# EAGLE design astable_555_timer (EAGLE 9.6.2)
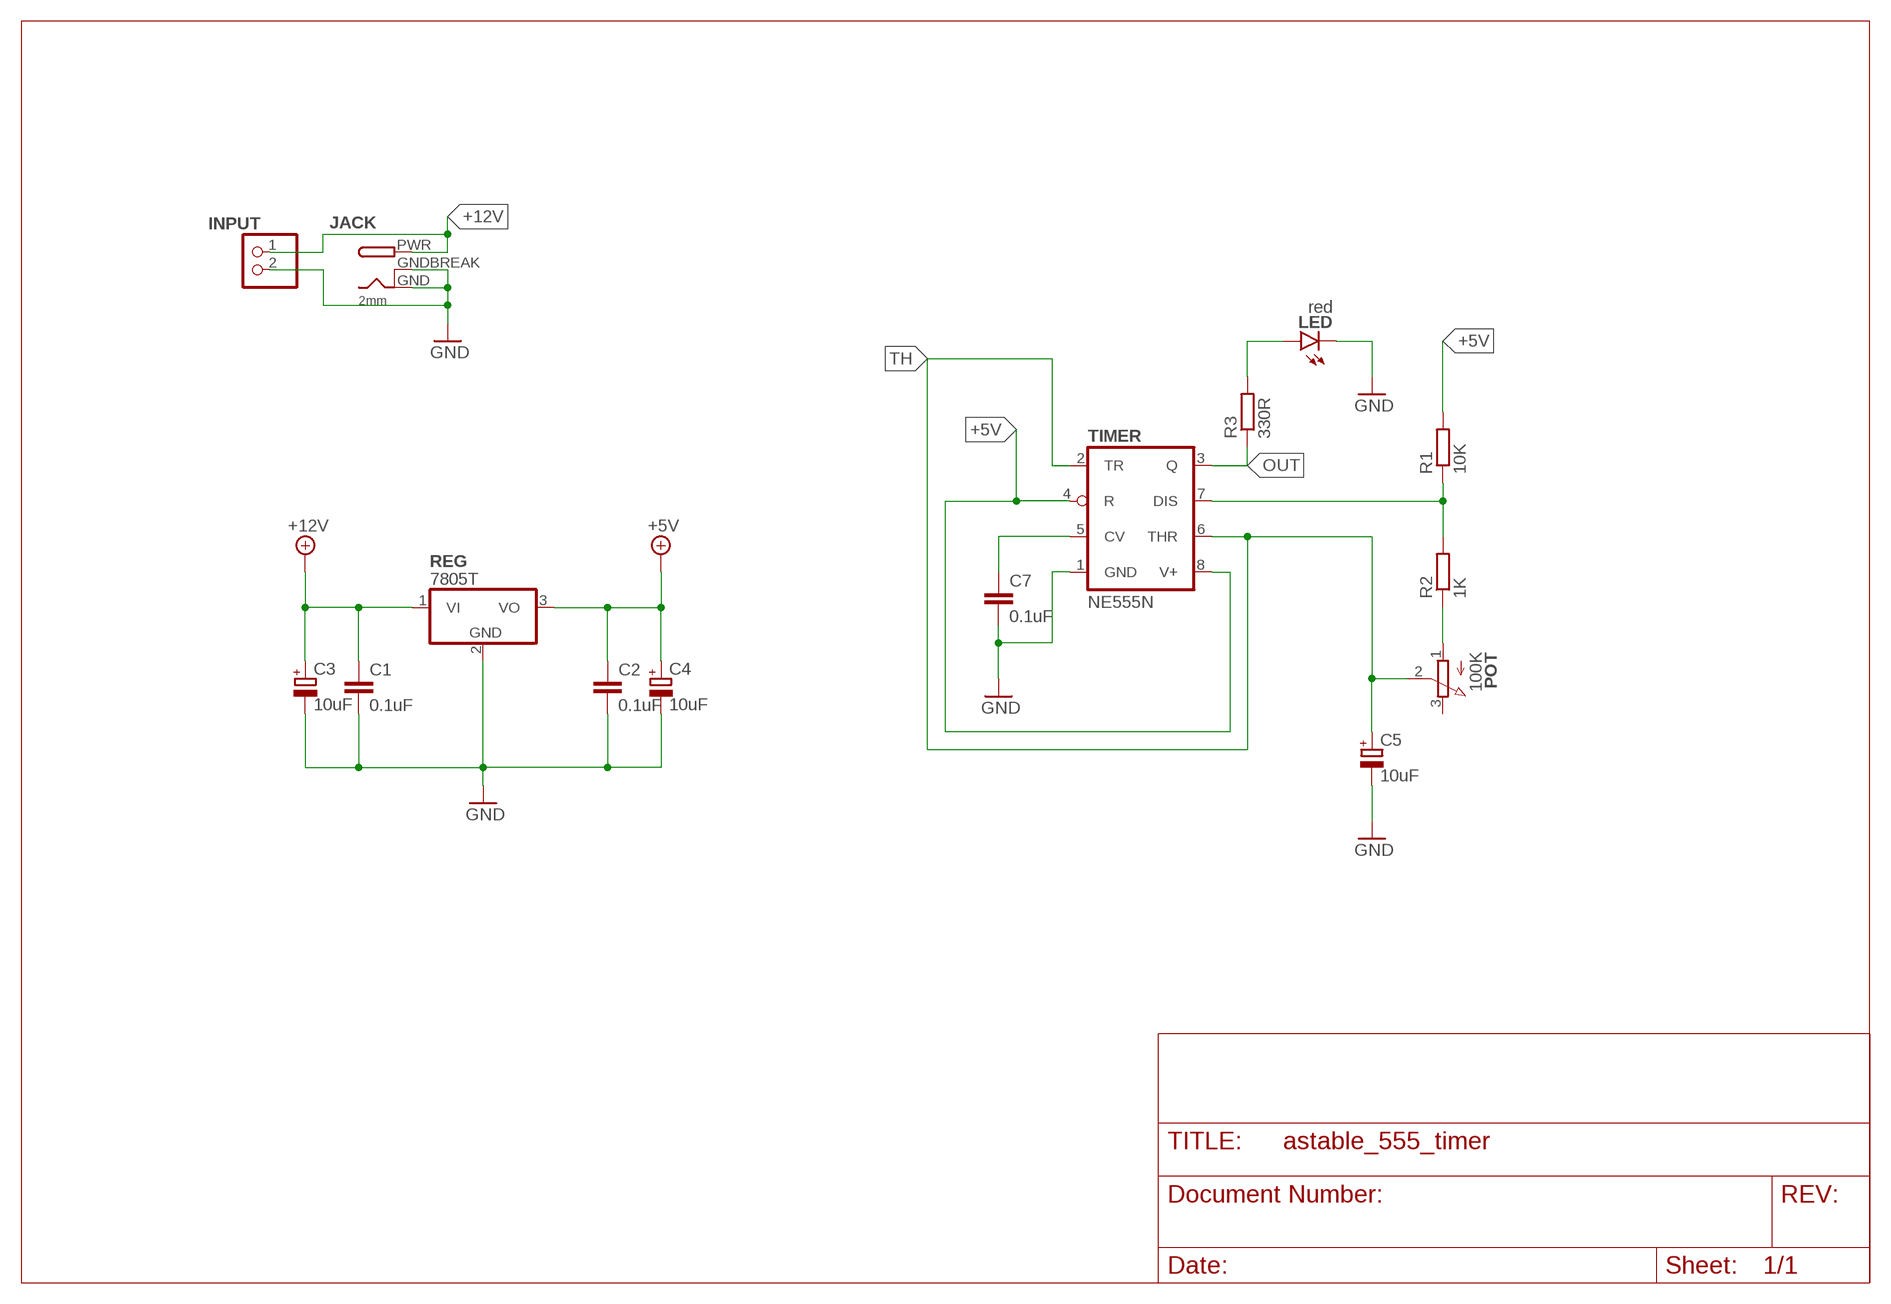
[diagram p0: schematic, sheet 1]

## Parts
C1  0.1uF  C-EU050-030X075  [C050-030X075]
C2  0.1uF  C-EU050-030X075  [C050-030X075]
C3  10uF  CPOL-EUE3.5-8  [E3,5-8]
C4  10uF  CPOL-EUE3.5-8  [E3,5-8]
C5  10uF  CPOL-EUE3.5-8  [E3,5-8]
C7  0.1uF  C-EU050-030X075  [C050-030X075]
INPUT  PINHD-1X2  [1X02]
JACK  2mm  DCBARRELPTH  [DCJACK_2MM_PTH]
LED  red  LED5MM  [LED5MM]
POT  100K  3RP/1610N  [3RP/1610N]
R1  10K  R-EU_0207/10  [0207/10]
R2  1K  R-EU_0207/10  [0207/10]
R3  330R  R-EU_0207/10  [0207/10]
REG  7805T  [TO220H]
TIMER  NE555N  [DIL08]

## Nets
+5V [power]: C2.1 C4.+ R1.2 REG.3(VO) TIMER.4(R) TIMER.8(V+)
+12V [power]: C1.1 C3.+ INPUT.1 JACK.PWR REG.1(VI)
GND: C1.2 C2.2 C3.- C4.- C5.- C7.2 INPUT.2 JACK.GND JACK.GNDBREAK LED.K(C) REG.2(GND) TIMER.1(GND)
N$3: LED.A R3.2
N$4: R1.1 R2.2 TIMER.7(DIS)
N$5: POT.1(A) R2.1
N$6: C7.1 TIMER.5(CV)
OUT: R3.1 TIMER.3(Q)
TH: C5.+ POT.2(S) TIMER.2(TR) TIMER.6(THR)
Unconnected: POT.3(E)

## Library data of the parts
C1 C2 C7 = rcl:C-EU: CAPACITOR, European symbol; SPICEPREFIX: C
C3-C5 = rcl:CPOL-EU: POLARIZED CAPACITOR, European symbol; SPICEPREFIX: C
INPUT = pinhead:PINHD-1X2: PIN HEADER
JACK = adafruit:DCBARREL: 2.0mm DC Barrel Jack DCJACK_2MM_PTH - Through Hole Jack (4UConnector: 05537)
LED = led:LED: LED OSRAM: - CHIPLED LG R971, LG N971, LY N971, LG Q971, LY Q971, LO R971, LY R971 LH N974, LH R974 LS Q976, LO Q976, LY Q976 LO Q996 - Hyper CHIPLED LW Q18S LB Q993, LB Q99A, LB R99A - SideLED LS A670, LO A670, LY A670, LG A670, LP A670 LB A673, LV A673, LT A673, LW A673 LH A674 LY A675 LS A676, LA A676, LO A676, LY A676, LW A676 LS A679, LY A679, LG A679 - Hyper Micro SIDELED® LS Y876, LA Y876, LO Y876, LY Y876 LT Y87S - SmartLED LW L88C, LW L88S LB L89C, LB L89S, LG L890 LS L89K, LO L89K, LY L89K LS L896, LA L896, LO L896, LY L896 - TOPLED LS T670, LO T670, LY T670, LG T670, LP T670 LSG T670, LSP T670, LSY T670, LOP T670, LYG T670 LG T671, LOG T671, LSG T671 LB T673, LV T673, LT T673, LW T673 LH T674 LS T676, LA T676, LO T676, LY T676, LB T676, LH T676, LSB T676, LW T676 LB T67C, LV T67C, LT T67C, LS T67K, LO T67K, LY T67K, LW E67C LS E67B, LA E67B, LO E67B, LY E67B, LB E67C, LV E67C, LT E67C LW T67C LS T679, LY T679, LG T679 LS T770, LO T770, LY T770, LG T770, LP T770 LB T773, LV T773, LT T773, LW T773 LH T774 LS E675, LA E675, LY E675, LS T675 LS T776, LA T776, LO T776, LY T776, LB T776 LHGB T686 LT T68C, LB T68C - Hyper Mini TOPLED® LB M676 - Mini TOPLED Santana® LG M470 LS M47K, LO M47K, LY M47K Source: http://www.osram.convergy.de LUXEON: - LUMILED® LXK2-PW12-R00, LXK2-PW12-S00, LXK2-PW14-U00, LXK2-PW14-V00 LXK2-PM12-R00, LXK2-PM12-S00, LXK2-PM14-U00 LXK2-PE12-Q00, LXK2-PE12-R00, LXK2-PE12-S00, LXK2-PE14-T00, LXK2-PE14-U00 LXK2-PB12-K00, LXK2-PB12-L00, LXK2-PB12-M00, LXK2-PB14-N00, LXK2-PB14-P00, LXK2-PB14-Q00 LXK2-PR12-L00, LXK2-PR12-M00, LXK2-PR14-Q00, LXK2-PR14-R00 LXK2-PD12-Q00, LXK2-PD12-R00, LXK2-PD12-S00 LXK2-PH12-R00, LXK2-PH12-S00 LXK2-PL12-P00, LXK2-PL12-Q00, LXK2-PL12-R00 Source: www.luxeon.com KINGBRIGHT: KA-3528ASYC Source: www.kingbright.com
POT = pot:3RP/1610N: 16mm Potentiometer one level Source: http://www.alphapotentiometers.net/html/16mm_pot_2.html
R1-R3 = rcl:R-EU_: RESISTOR, European symbol; SPICEPREFIX: R
REG = linear:78*: Positive VOLTAGE REGULATOR Source: http://cache.national.com/ds/LM/LM78L05.pdf http://www.fairchildsemi.com/ds/LM/LM7805.pdf
TIMER = linear:*555: TIMER

## Net classes
0 default: width 0.305 mm, drill 0.305 mm, clearance 0.254 mm
1 power: width 0.406 mm, drill 0.406 mm, clearance 0.305 mm

## Board
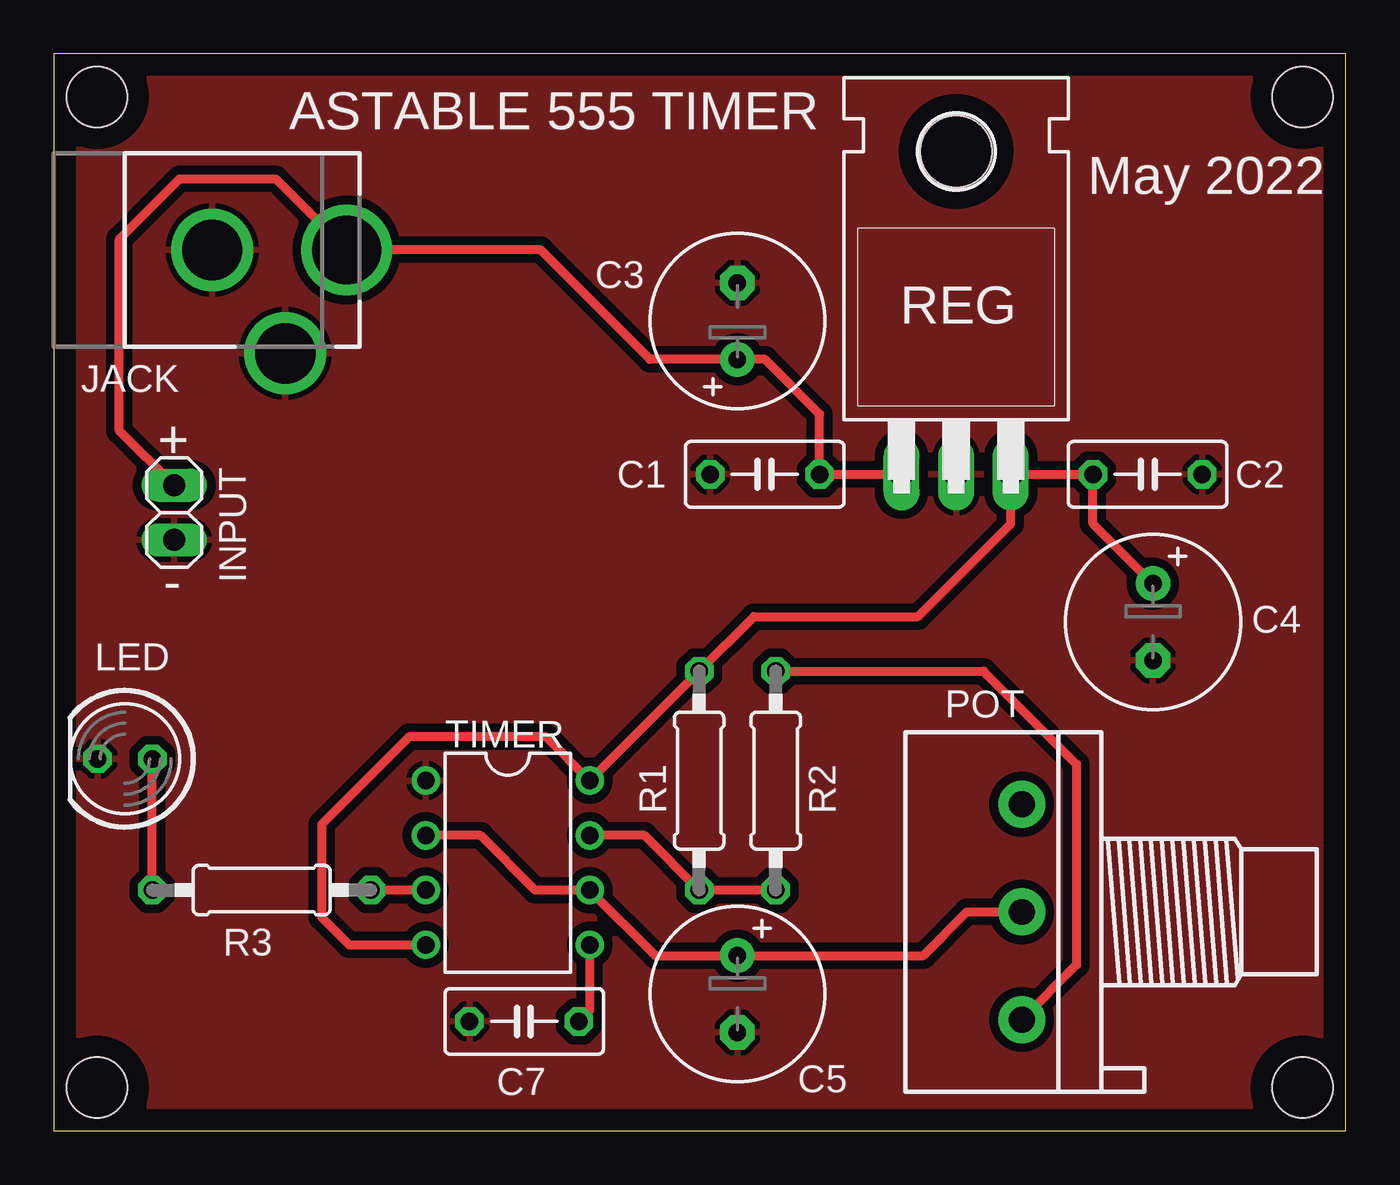
[diagram p1: board, top side]

Size 60 x 50 mm. Coordinates in mm from the lower left corner, seen from the top.
Outline: 0,0 60,0 60,50 0,50 0,0
Copper layers (1*16): Top 0.035mm / dielectric 1.5mm / Bottom 0.035mm
Design rules "default": minimum track width 6mil, minimum drill 0.35mm, track to track 6mil, track to pad 6mil, pad to pad 6mil, via to via 6mil, smd to smd 6mil, copper to edge 40mil, drill to drill 6mil, minimum pad ring 10mil, minimum via ring 8mil, stop-mask expansion 4mil, vias tented up to drill 0mil, thermal gap 10mil
Holes 2.8 mm at 2,48 58,48 2,2 58,2

### Footprints (pad centres in the part's own frame; a part is rotated, then mirrored left to right if it is on the bottom)
C050-030X075 = drill 0.813 octagon: 1 -2.54,0; 2 2.54,0
E3,5-8 = drill 0.813 pad 1.6: + -1.778,0 | drill 0.813 pad 1.6 octagon: - 1.778,0
1X02 = drill 1.016 long: 1 -1.27,0; 2 1.27,0
DCJACK_2MM_PTH = drill 2.8: GND 0,7.35; GNDBREAK 4.8,10.75 | drill 3.2: PWR 0,13.6
LED5MM = drill 0.813 octagon: A -1.27,0; K 1.27,0
3RP/1610N = drill 1.2 pad 2.184: 1 -5,0; 2 0,0; 3 5,0
0207/10 = drill 0.813 octagon: 1 -5.08,0; 2 5.08,0
TO220H = drill 1.118 long: 1 -2.54,-10.16; 2 0,-10.16; 3 2.54,-10.16 | hole 3.302: 0,4.826
DIL08 = drill 0.813 pad 1.27: 1 -3.81,-3.81; 2 -1.27,-3.81; 3 1.27,-3.81; 4 3.81,-3.81; 5 3.81,3.81; 6 1.27,3.81; 7 -1.27,3.81; 8 -3.81,3.81

### Placement (x,y rotation side)
C1  33.02,30.48 180 top
C2  50.8,30.48 0 top
C3  31.75,37.59 90 top
C4  51.05,23.62 270 top
C5  31.75,6.35 270 top
C7  21.84,5.08 180 top
INPUT  5.59,28.7 270 top
JACK  0,40.89 270 top
LED  3.3,17.27 180 top
POT  44.96,10.16 90 top
R1  29.97,16.26 90 top
R2  33.53,16.26 270 top
R3  9.65,11.18 180 top
REG  41.91,40.64 0 top
TIMER  21.08,12.45 270 top

### Tracks (layer width: path | path; a pad name or v marks a point on that pad's centre or on a via)
+5V
  Top 0.406: C4.+ 48.26,28.19 C2.1 REG.3 44.45,28.19 40.13,23.88 32.51,23.88 R1.2 TIMER.8 22.86,18.29 16.51,18.29 12.45,14.22 12.45,9.91 13.72,8.64 TIMER.4
+12V
  Top 0.406: INPUT.1 3.05,32.51 3.05,41.4 5.84,44.2 10.3,44.2 JACK.PWR 22.61,40.89 27.69,35.81 C3.+ 33.02,35.81 35.56,33.27 C1.1 REG.1
GND
  pour Top (isolate 0.406): 0,50.04 59.94,50.04 59.94,0 0,0
N$3
  Top 0.406: R3.2 LED.A
N$4
  Top 0.406: R2.2 R1.1 27.43,13.72 TIMER.7
N$5
  Top 0.406: R2.1 43.18,21.34 47.5,17.02 47.5,7.7 POT.1
N$6
  Top 0.406: TIMER.5 24.89,5.59 C7.1
OUT
  Top 0.406: TIMER.3 R3.1
TH
  Top 0.406: TIMER.2 19.81,13.72 22.35,11.18 TIMER.6 27.94,8.13 C5.+ 40.39,8.13 42.42,10.16 POT.2

### Text on the board
tNames: ASTABLE 555 TIMER | May 2022 | + | -